# Altium schematic sheet Input-Connectors.SchDoc
size A
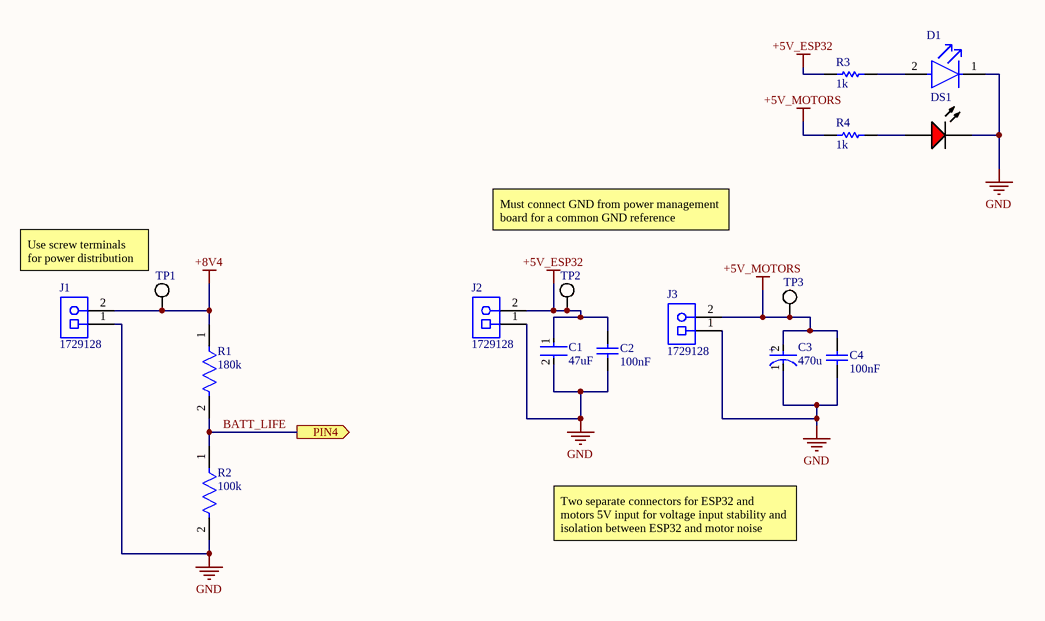
[diagram p0: Input-Connectors.SchDoc]

## Parts
C1  47uF  [FP-CL32-IPC_C]
C2  100nF  [CAPC1206(3216)170_L]
C3  470u  [FP-RAD-TH-D_10_0_5-L_12_5-MFG]
C4  100nF  [CAPC1206(3216)170_L]
D1  598-8270-107F  [FP-598-8270-107F-MFG]  (value not drawn)
DS1  SML-LX1206IC-TR  [LUMX-SML-LX1206IC_V]  (value not drawn)
J1  1729128  [PHOE-1729128-2_V]
J2  1729128  [PHOE-1729128-2_V]
J3  1729128  [PHOE-1729128-2_V]
R1  180k  [FP-CRCW1206-e3-IPC_B]
R2  100k  [FP-RP732B-MFG]
R3  1k  [RESC3216X60X45ML10T20]
R4  1k  [RESC3216X60X45ML10T20]
TP1  Test Point  [Test Point]  (value not drawn)
TP2  Test Point  [Test Point]  (value not drawn)
TP3  Test Point  [Test Point]  (value not drawn)

## Ports
PIN4 (out)

## Nets
+5V_ESP32: C1.1 C2.2 J2.2 R3.1 TP2.1
+5V_MOTORS: C3.2(A) C4.2 J3.2 R4.1 TP3.1
+8V4: J1.2 R1.1 TP1.1
GND: C1.2 C2.1 C3.1(C) C4.1 D1.1(C) DS1.2(K) J1.1 J2.1 J3.1 R2.2
BATT_LIFE: R1.2 R2.1 ; port PIN4
NetD1_2: D1.2(A) R3.2
NetDS1_1: DS1.1(A) R4.2

## Notes on the sheet
- Must connect GND from power management board for a common GND reference
- Use screw terminals for power distribution
- Two separate connectors for ESP32 and motors 5V input for voltage input stability and isolation between ESP32 and motor noise
- (in symbol CMP-05427-001980-1) +

## Library data of the parts
C1 = CMP-13271-000441-1: Cap Ceramic 47uF 16V X5R ±20% SMD 1210 +85°C Embossed T/R; CL32A476MOJNNWE
C2 C4 = CMP-1037-04201-1: CAP 100nF 50V ±10% 1206 (3216 Metric) Thickness 1.7mm SMD; Case-Metric: 3216; Tolerance: Â±10%; Case-EIA: 1206; Value: 100nF; Max Thickness: 1.7 mm; Rated Voltage: 50 V; Technology: SMT
C3 = CMP-05427-001980-1: Aluminum Electrolytic Capacitors (Radial Lead Type) 470uF ±20% 16V; Ripple Current: 1.29A; ESR (Equivalent Series Resistance): 38mR; Life (Hours): 4000Hour; Lead Diameter: 0.6mm; Height: 12.5mm; Package Quantity: 500; Lead Free: Lead Free; Voltage Rating: 16V; Diameter: 10mm; Radiation Hardening: No; Packaging: Tape and Reel; Case/Package: Radial; Tolerance: 20%; Series: FM; Capacitance: 470uF; Height - Seated (Max): 0.551inch; Max Operating Temperature: 105°C; Termination: Radial; Mount: Through Hole; RoHS Compliant: Yes; Voltage Rating (DC): 16V; Impedance: 38mR; Length: 12.5mm; Lead Pitch: 5mm; Min Operating Temperature: -40°C
D1 = CMP-15384-000006-1: SM LED 1206 ALINGAP G 7 REEL; Reverse Voltage: 5V; Viewing Angle: 140°; Power Dissipation: 60mW; Number of Elements: 1; Luminous Intensity: 20mcd; Color: Green; Lens Size: 1.6mm; Dominant Wavelength: 570nm; Test Current: 20mA; Forward Voltage: 2V; Lens Color: Colorless; Lens Transparency: Clear; Lens Style: Flat; Case/Package: 1206; RoHS Compliant: Yes; Number of Pins: 2; Packaging: Tape and Reel; Case Code (Metric): 3216; Lead Free: Lead Free; REACH SVHC: No SVHC; Height: 0.7mm; Depth: 1.6mm; Radiation Hardening: No; Length: 3.2mm; Wavelength: 570nm; Illumination Color: Green; Max Operating Temperature: 85°C; Min Operating Temperature: -30°C; Case Code (Imperial): 1206; Series: 598; Package Quantity: 3000; Mount: Surface Mount; Number of LEDs: 1; Forward Current: 20mA; Width: 1.6mm
DS1 = CMP-2000-07123-1: LED Red, 65 mW, -40 to 85 degC, 2-Pin SMD, RoHS, Tape and Reel; Manufacturer: Lumex; LED Material: GaAsP; Peak Wavelength: 635nm; Number of LEDs: 1; Viewing Angle: 160; Reverse Voltage: 5(Min)V; Lens Appearance: ColorlessNonDiffused; Intensity: 6mcd; Type: Uni-Color; Pin_Count: 2; Lens Dimensions: 2x1.6x0.5mm; Mounting: SurfaceMount; ECCN: EAR99; RoHS: Unknown; Package Description: 2-Pin Surface Mount Device, Body 3.2 x 1.5 mm; Mounting Technology: SurfaceMount; Dominant Wavelength: N/A; Supplier_Package: SMD; Supplier Standard Pack: 3,000; Color: Red; Dimension: 3.2x1.6x1.1mm; HTS: 8541402000; Part No: SML-LX1206IC-TR; Family: SML-LX1206IC; Supplier: Lumex; Datasheet URL: http://www.lumex.com/content/files/ProductAttachment/SML-LX1206IC-TR.pdf; Package Reference: SML-LX1206IC; Manufacturer URL: http://www.lumexinstruments.com/; Operating Temperature: -25to85C; Packaging: TapeandReel; Datasheet Version: Rev. J, 08/2012
J1-J3 = CMP-2000-05815-1: PCB Terminal Block, 13.5 A, 400 V, 2-Pin THD, RoHS, Bulk; Manufacturer: Phoenix Contact; Package Version: 03/2015; No. of Rows: 1; Pitch: 5.08mm; No. of Positions: 2; Voltage Rating: 400V; Current Rating: 13500mA; Manufacturer URL: http://www.phoenixcontact.com/; Datasheet URL: https://datasheet.ciiva.com/16046/1729128-16046181.pdf; RoHS: TRUE; Package URL: https://www.phoenixcontact.com/online/portal/pi/pxc/product_detail_page/!ut/p/b1/3VdJjqNKFDxLH8AFycySyWY2ozFsEPOMMQaDOX1XedGL_1Vdm5YXJleknhSKeBkvI6EA8ncAo3AYoDhBQGco6KN7VURTdemj9us_IEKEZo_YHiPAEWEFmDGOHMORkqKYCORBZxgL7ZoaZYcbFFUZ3fqxSY6GOuxydWUuHqz1ynmMFygu583Bob0Ewr6Sd_l-5m-kAueHiB0jpRwZwe58wwtkpxtMYd_LmGcDRU02dRNEyWt6Y2ti5pSyJ_reIkzIulrqApdnbT11V5jnCKbYNCvhEM1MCpPByat_X379-iThf08CI5GfOPqfBeS3BRoBOdD55AKVv0iLwCMq-2BrzXWSGRH7pUGD9uwXQjiph3xL0DKQwdGa0JImiIOmBNOestqgwTHSSs2oOep-78apyXQBvNi8ZLaFjvjWvcaUEBu0MC6Wbe-d6mB0FAebo2lUWinqYaZs5DAYzV0RP9yitUjnGJ0iI9xhZkT42OCQNUJJhkgWINNQLP2JFP6OpMg3JCVg70jqHT0lvKOnhHf0lPuOnnLf0VPuWx6_dxwUIvwk5WMkT0kLL1mh61l2yZVSzG3pYV_bqo-mj6uMKwKwdnnW8Jh5RTOJzMOA5c-eJDaZQw4mTMPH02PvS_ZAqNVjVTo2WyYLkwH_KU1mmmG5kjRhDqPXLwwVHvVOjCM60-fpXvTDfMGW1PVFVS1r4e4yVDk4ZdNbkUHvqPqQSeian4UD39fNKmachqdJ1NJbyk8rXT9mXTvPk3oE5meulKGgiruPJek-4I9hTT6G8ZLOyRSm2RRVbThERQad5OS28hdt4YW4vG0stgYYzsWsK4_7y6DZMjJSCqri1kyiZR5vD7pwIrNR7QwPHTcLTI5qT7eRlpHrdGiupYlqQDJ7zy_CND8fWWBoLRXxk1RVcXiBQwbTD4Xi7KL-FuO94t9xaqweXzH; PartNumber: 1729128; Package Description: 2-Pin Through Hole Device, Body 8.1 x 10.16 mm, Pitch 5.08 mm; Datasheet Version: 12/2013; Mounting Technology: ThroughHole; Orientation: Horizontal; Package Reference: 1729128-2; Packing: Bulk
R1 = CMP-2003-01847-2: RES Thick Film, 180kΩ, 5%, 0.25W, 200ppm/°C, 1206; Voltage Rating (DC): 200V; Resistance: 180kR; Power Rating: 250mW; Min Operating Temperature: -55°C; Weight: 0.000353oz; Max Operating Temperature: 155°C; Height: 0.024inch; Radiation Hardening: No; Termination: SMD/SMT; Case/Package: 1206; Contact Plating: Tin; Voltage Rating: 200V; Number of Terminations: 2; Temperature Coefficient: 200ppm/°C; Packaging: Tape and Reel; Mount: Surface Mount; Military Standard: Not; Package Quantity: 1; Depth: 1.6mm; Features: Automotive AEC-Q200; Case Code (Imperial): 1206; Case Code (Metric): 3216; Max Power Dissipation: 250mW; Width: 0.063inch; Composition: Thick Film; Lead Free: Lead Free; Length: 3.2mm; Tolerance: 5%
R2 = CMP-03211-007900-1: Res Thin Film 1206 100KΩ 0.1% 0.25W 15ppm/°C Molded SMD; Manufacturer: TE Connectivity; Manufacturer Part Number: RP73D2B100KBTG; Voltage Rating: 200V; ComponentLink2URL: https://www.te.com/commerce/DocumentDelivery/DDEController?Action=showdoc&DocId=Data+Sheet%7F1773272%7FL%7Fpdf%7FEnglish%7FENG_DS_1773272_L.pdf%7F8-1879255-6; Category: Res; Temperature Coefficient: 15ppm/°C; Temperature Range High: 155°C; Height: 0.65mm; Ipc Land Pattern Name: RESC305155X55; Power Rating: 0.25W; Tolerance: 0.1%; ComponentLink2Description: Datasheet; Value: 100KΩ; Series: RP73; Octopart: https://octopart.com/rp73d2b100kbtg-te+connectivity-42012337; Automotive: No; packaging: 250 cut tape length; Temperature: -55°C to 155°C; octopart_url: https://octopart.com/rp73d2b100kbtg-te+connectivity-42012337; Lead Free: Yes; Device Class L2: Resistors; RoHS: TRUE; Composition: Thin Film; Device Class L3: Chip SMD Resistors; Package: RP732B; Device Class L1: Passive Components; Temperature Range Low: -55°C; Resistance: 100KΩ
R3 R4 = CMP-2003-01869-1: Manufacturer: Vishay Dale; Part Number: CRCW12061K00JNTA
TP1-TP3 = CMP-00030-00006-7